# Altium schematic sheet Cover_SchDoc.SchDoc
size A3; DocumentNumber: 1; SheetNumber: 2; SheetTotal: 5
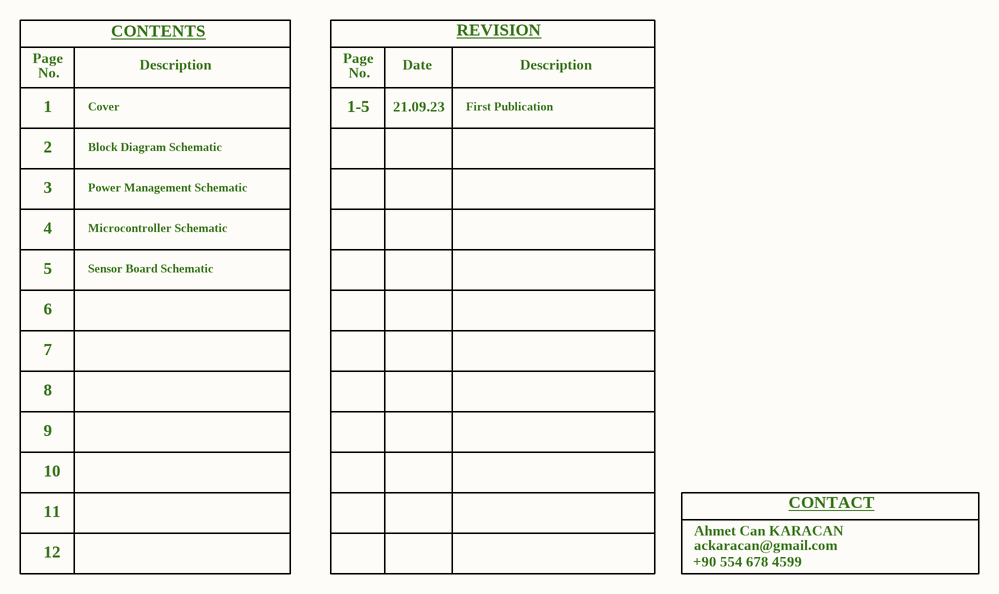
[diagram p0: Cover_SchDoc.SchDoc]

## Notes on the sheet
- CONTENTS
- REVISION
- Page
- No.
- 1
- Cover
- Description
- 1-5
- 21.09.23
- Date
- First Publication
- 2
- Block Diagram Schematic
- 3
- 4
- Power Management Schematic
- Microcontroller Schematic
- 5
- 6
- Sensor Board Schematic
- 7
- 8
- 9
- 10
- 11
- CONTACT
- 12
- +90 554 678 4599
- Ahmet Can KARACAN
- ackaracan@gmail.com
- Document Name
- Prepared By
- Company Name
- Checked By
- A. Can KARACAN
- Release Date
- Department
- R&D- Hardware
- Size
- Change Date
- A3
- Approved By
- Sheet
- /